# EasyEDA schematic Schematic_Lazy-bot_v0.1.4.json
TITLE: Lazy-bot; REV: v0.1.4; Date: 2022-11-09; Sheet: 1/1; Drawn By: Team Lazy-go; Company: Team Lazy-go
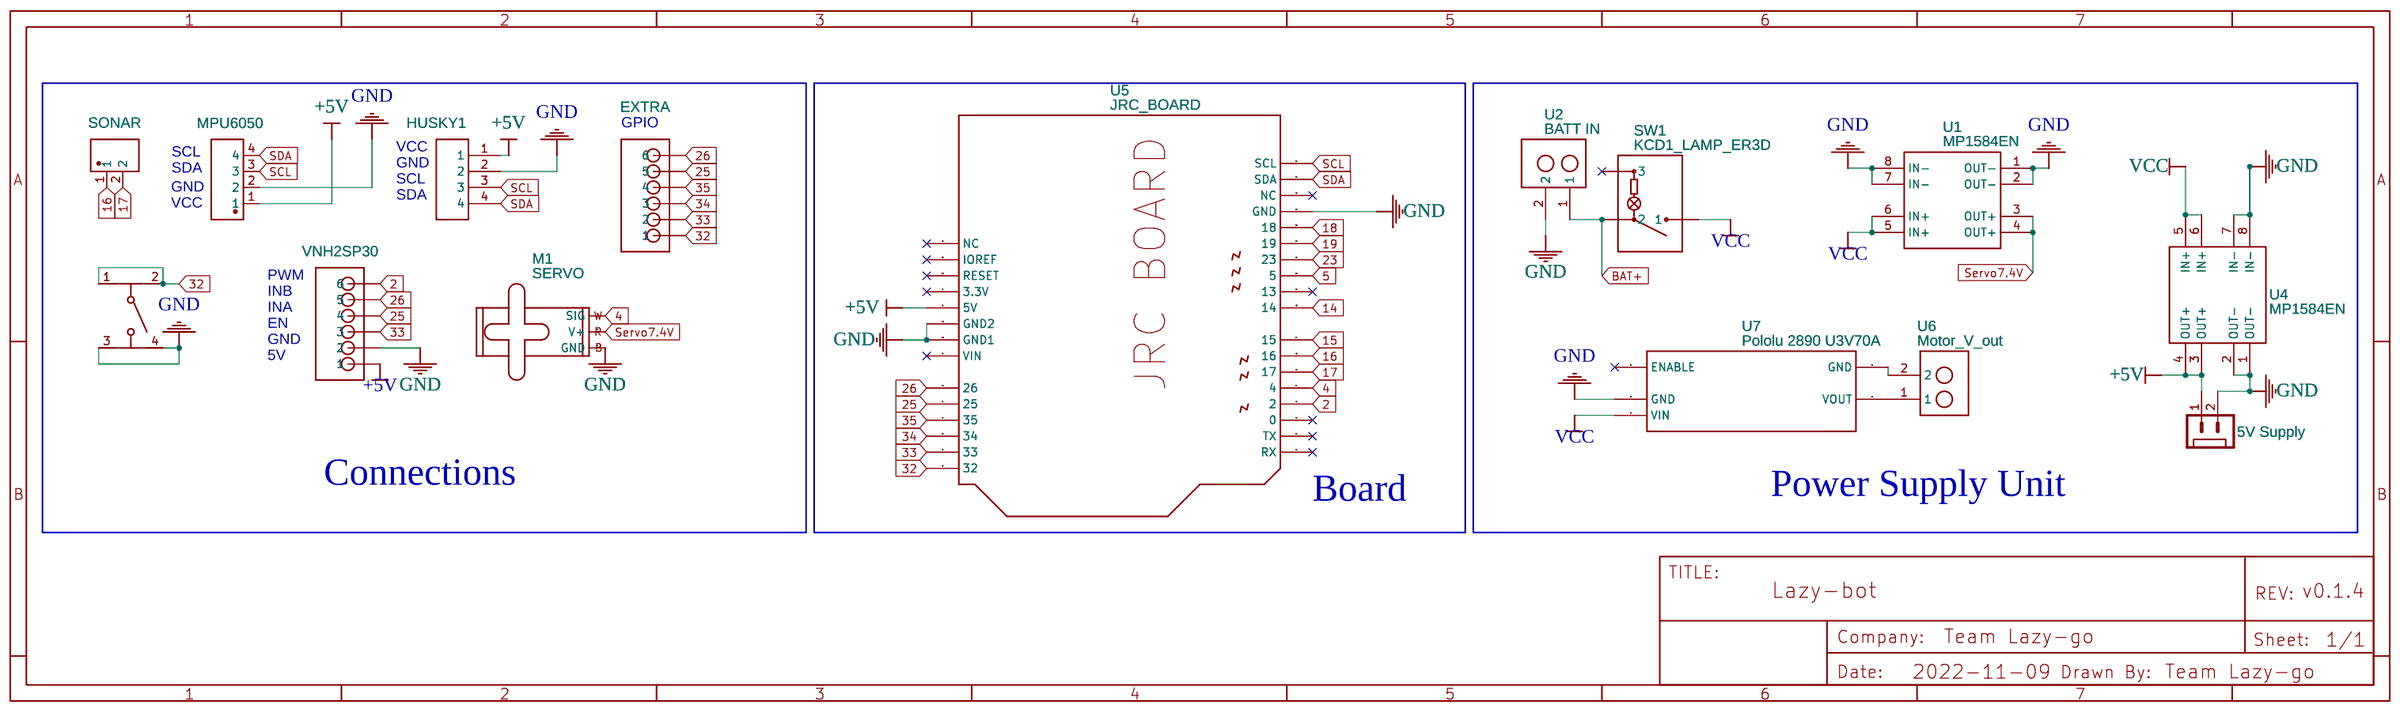
[diagram p0: schematic sheet]

## Parts
1V_5  5V Supply  [JST-2.54-2PIN-CONNECTOR]
EXTRA  JST-XH-6-PIN-HEADER-2.5  [JST-XH-6PIN-2.5]
HUSKY1  HUSKY  [4PIN]
M1  SERVO  [1X03]
MPU6050  VL53L0X  [CONN-TH_4P-P2.50_4PIN]
SONAR  CONZC2_0-2  [CONN-TH_2P-P2.50-XH2.54-2P]
SW1  KCD1_LAMP_ER3D  [KCD1-203]
SW2  12mm x 12mm tactile push button  [BIG TACTILE PUSH BUTTON]
U1  MP1584EN  [MP1484EN DC-DC BUCK CONVERTER (7.5X8.5)]
U2  BATT IN  [2 PIN TERMINAL]
U4  MP1584EN  [MP1484EN DC-DC BUCK CONVERTER (7.5X8.5)]
U5  JRC_BOARD  [ARDUINO UNO INVERTED]
U6  Motor_V_out  [2 PIN TERMINAL]
U7  Pololu 2890 U3V70A  [POLOLU 2890 4.5-20V FINE-ADJUST STEP-UP VOLTAGE REGULATOR U3V70A]
VNH2SP30  JST-XH-6-PIN-HEADER-2.5  [JST-XH-6PIN-2.5]

## Library data of the parts
1V_5 = 2PIN-HEADER-2.54: Contributor: Павел Колесов
EXTRA VNH2SP30 = JST-XH-6-PIN-HEADER-2.5: Contributor: hs3uka
HUSKY1 = 4PIN: Contributor: starrytime
M1 = SMALL_SERVO: Small servo motor; Contributor: SparkFun
MPU6050 = 4PIN白色直针插座: Supplier: LCSC; Supplier Part: C9900004960; Contributor: LCSC; JLCPCB Part Class: Extended Part; Manufacturer: null
SONAR = CONZC2_0-2: Supplier: LCSC; Supplier Part: C9900010743; Manufacturer: null; Contributor: LCSC; JLCPCB Part Class: Extended Part
SW1 = KCD1_LAMP_ER3D: Supplier: LCSC; Supplier Part: C309263; Manufacturer: ROCKTEK; Manufacturer Part: RT-S02-113-R42BR; Contributor: iylee
SW2 = 12mm x 12mm tactile push button: Contributor: adeelmoizzafar802
U1 U4 = MP1484EN DC-DC Buck 4.2-23V Input Step-Down Regulator Converter Adjustable Output: Supplier Part: https://goo.gl/G1LPMP; Contributor: dotsha747
U2 U6 = 2 pin terminal: Supplier: Wemos; Contributor: Dimitrij Akimov
U5 = ARDUINO UNO INVERTED: Arduino DiecimilaDuemilanove; Contributor: Adafruit
U7 = Pololu 2890 U3V70A: Manufacturer Part: 2890; Contributor: XYZ-TC; Supplier Part: 2570; link: https://www.pololu.com/product/2890

## Nets
+5V: 1V_5.1(5V) HUSKY1.1 MPU6050.1 U4.3(OUT+) U4.4(OUT+) U5.5V VNH2SP30.1
GND: 1V_5.2(GND) HUSKY1.2 M1.3(GND) MPU6050.2 SW2.3 SW2.4 U1.1(OUT-) U1.2(OUT-) U1.7(IN-) U1.8(IN-) U2.2 U4.1(OUT-) U4.2(OUT-) U4.7(IN-) U4.8(IN-) U5.GND U5.GND1 U5.GND2 U6.2 U7.GND VNH2SP30.2
VCC: SW1.1 U1.5(IN+) U1.6(IN+) U4.5(IN+) U4.6(IN+) U7.VIN
2: U5.D3(2) VNH2SP30.6
4: M1.1(SIG) U5.D4(4)
5: U5.D10(5)
14: U5.D8(14)
15: U5.D7(15)
16: SONAR.1 U5.D6(16)
17: SONAR.2 U5.D5(17)
18: U5.D13(18)
19: U5.D12(19)
23: U5.D11(23)
25: EXTRA.5 U5.A1(25) VNH2SP30.4
26: EXTRA.6 U5.A0(26) VNH2SP30.5
32: EXTRA.1 SW2.1 SW2.2 U5.A5(32)
33: EXTRA.2 U5.A4(33) VNH2SP30.3
34: EXTRA.3 U5.A3(34)
35: EXTRA.4 U5.A2(35)
BAT+: SW1.2 U2.1
SCL: HUSKY1.3 MPU6050.3 U5.SCL
SDA: HUSKY1.4 MPU6050.4 U5.SDA
Servo7.4V: M1.2(V+) U1.3(OUT+) U1.4(OUT+)
Net-(U6-1): U6.1 U7.VOUT

Not connected (* = marked no-connect by the designer): SW1 3*; U5 3V(3.3V)* AREF(NC)* D0(RX)* D1(TX)* D2(0)* D9(13)* IOREF* NC* RESET* VIN*; U7 ENABLE*

## Notes on the sheet
- GPIO
- SCL
- VCC
- SDA
- GND
- GND
- SCL
- VCC
- SDA
- PWM
- INB
- EN
- INA
- GND
- 5V
- Connections
- Board
- Power Supply Unit
